# EAGLE design RFID_reva (EAGLE 7.2.0)

## Sheet 1 of 2
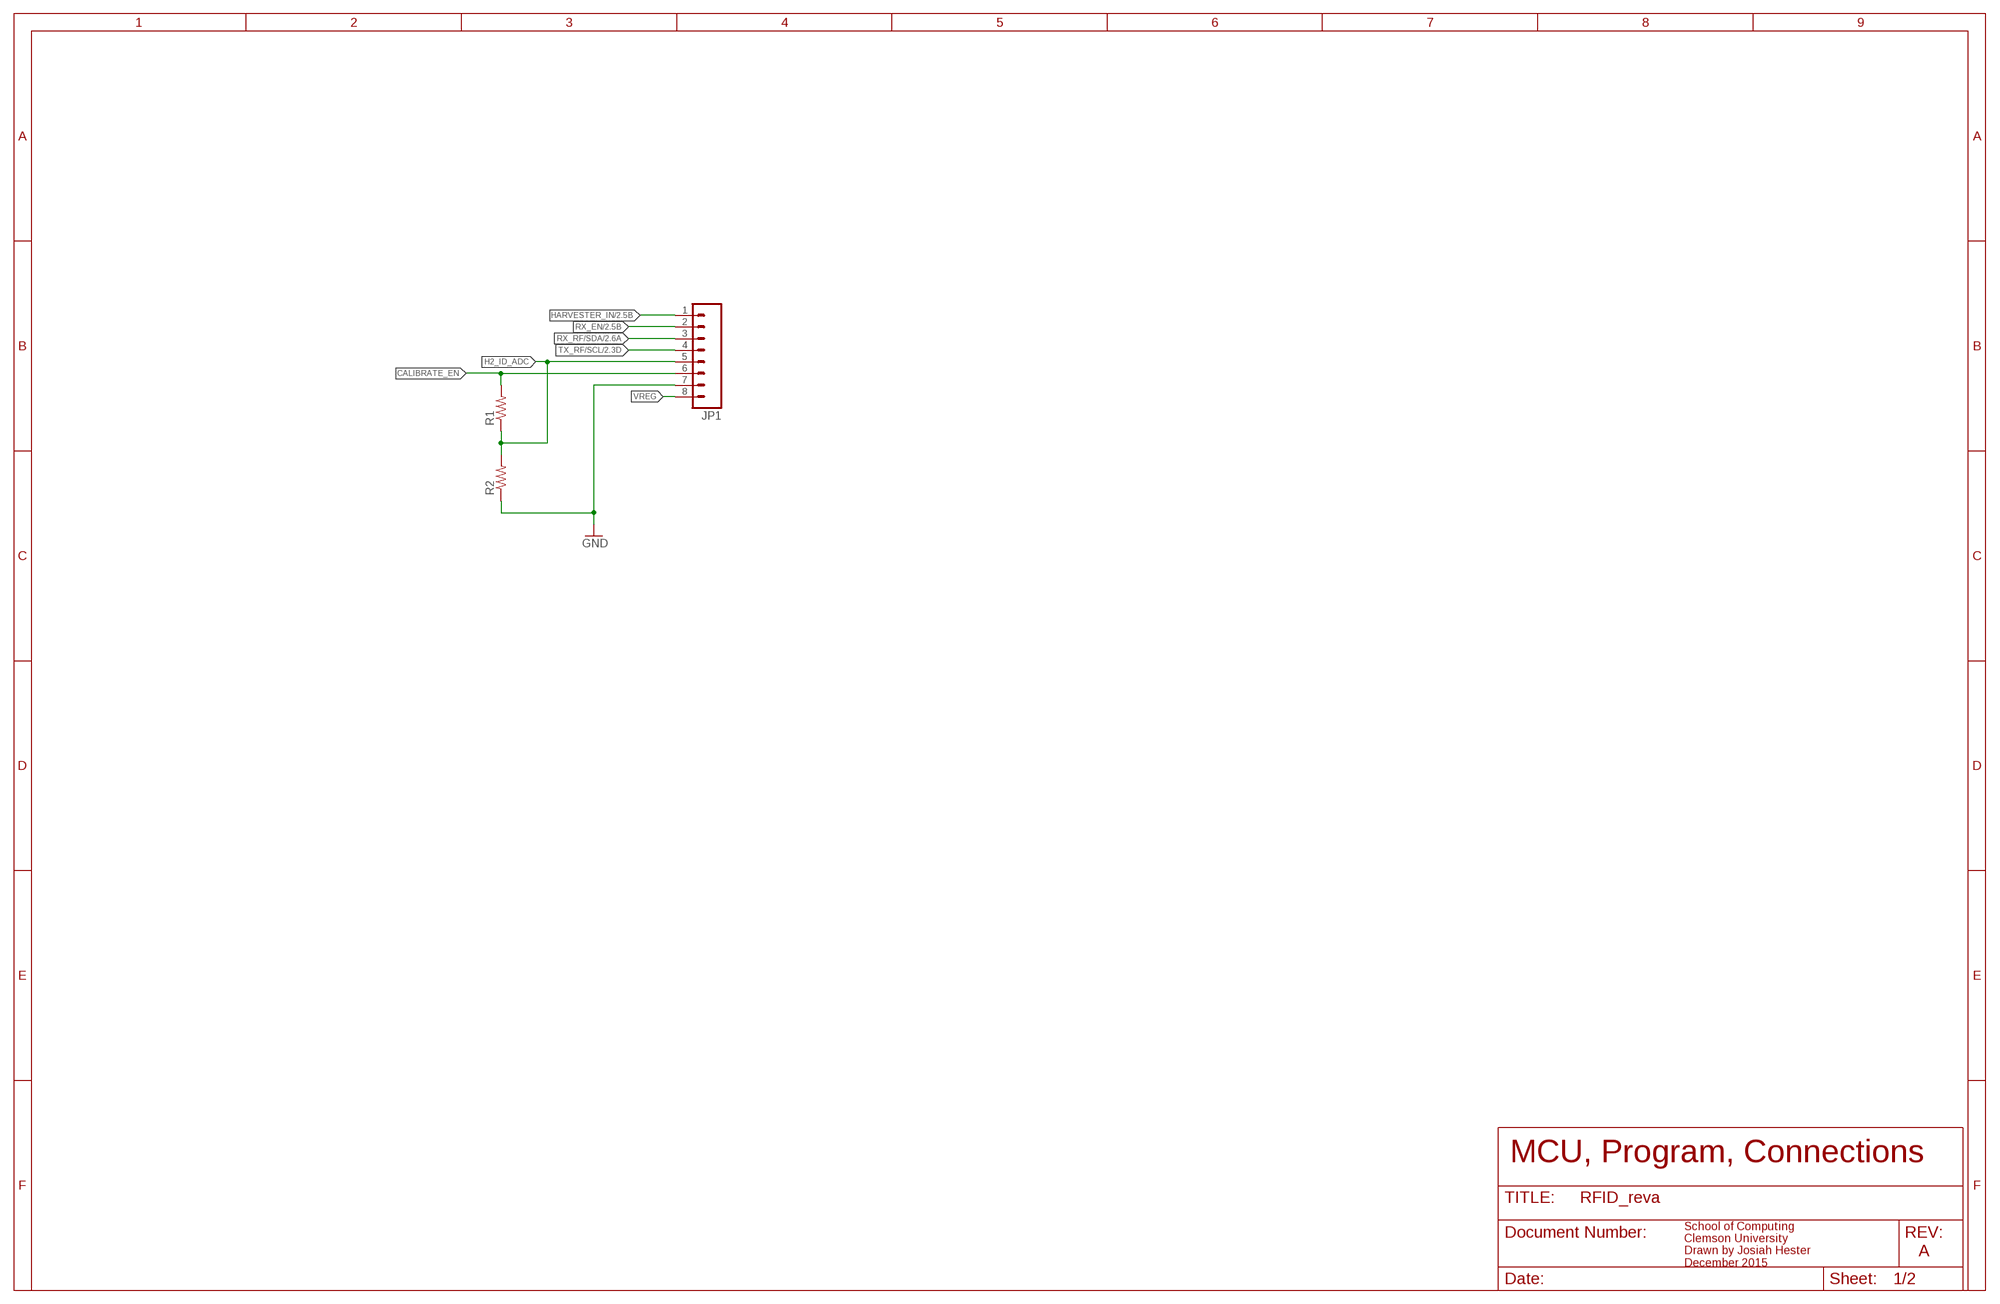
[diagram p0: schematic, sheet 1]

### Parts
JP1  M081.27MM  [1X08-1.27MM]
R1  R-EU0603  [0603]
R2  R-EU0603  [0603]

### Nets
CALIBRATE_EN: JP1.6 R1.2
GND: JP1.7 R2.1 ; also sheet 2
H2_ID_ADC: JP1.5 R1.1 R2.2
HARVESTER_IN: JP1.1 ; also sheet 2
RX_EN: JP1.2 ; also sheet 2
RX_RF/SDA: JP1.3 ; also sheet 2
TX_RF/SCL: JP1.4 ; also sheet 2
VREG: JP1.8 ; also sheet 2

### Notes on the sheet
- MCU, Program, Connections
- A
- School of Computing
  Clemson University
  Drawn by Josiah Hester
  December 2015

## Sheet 2 of 2
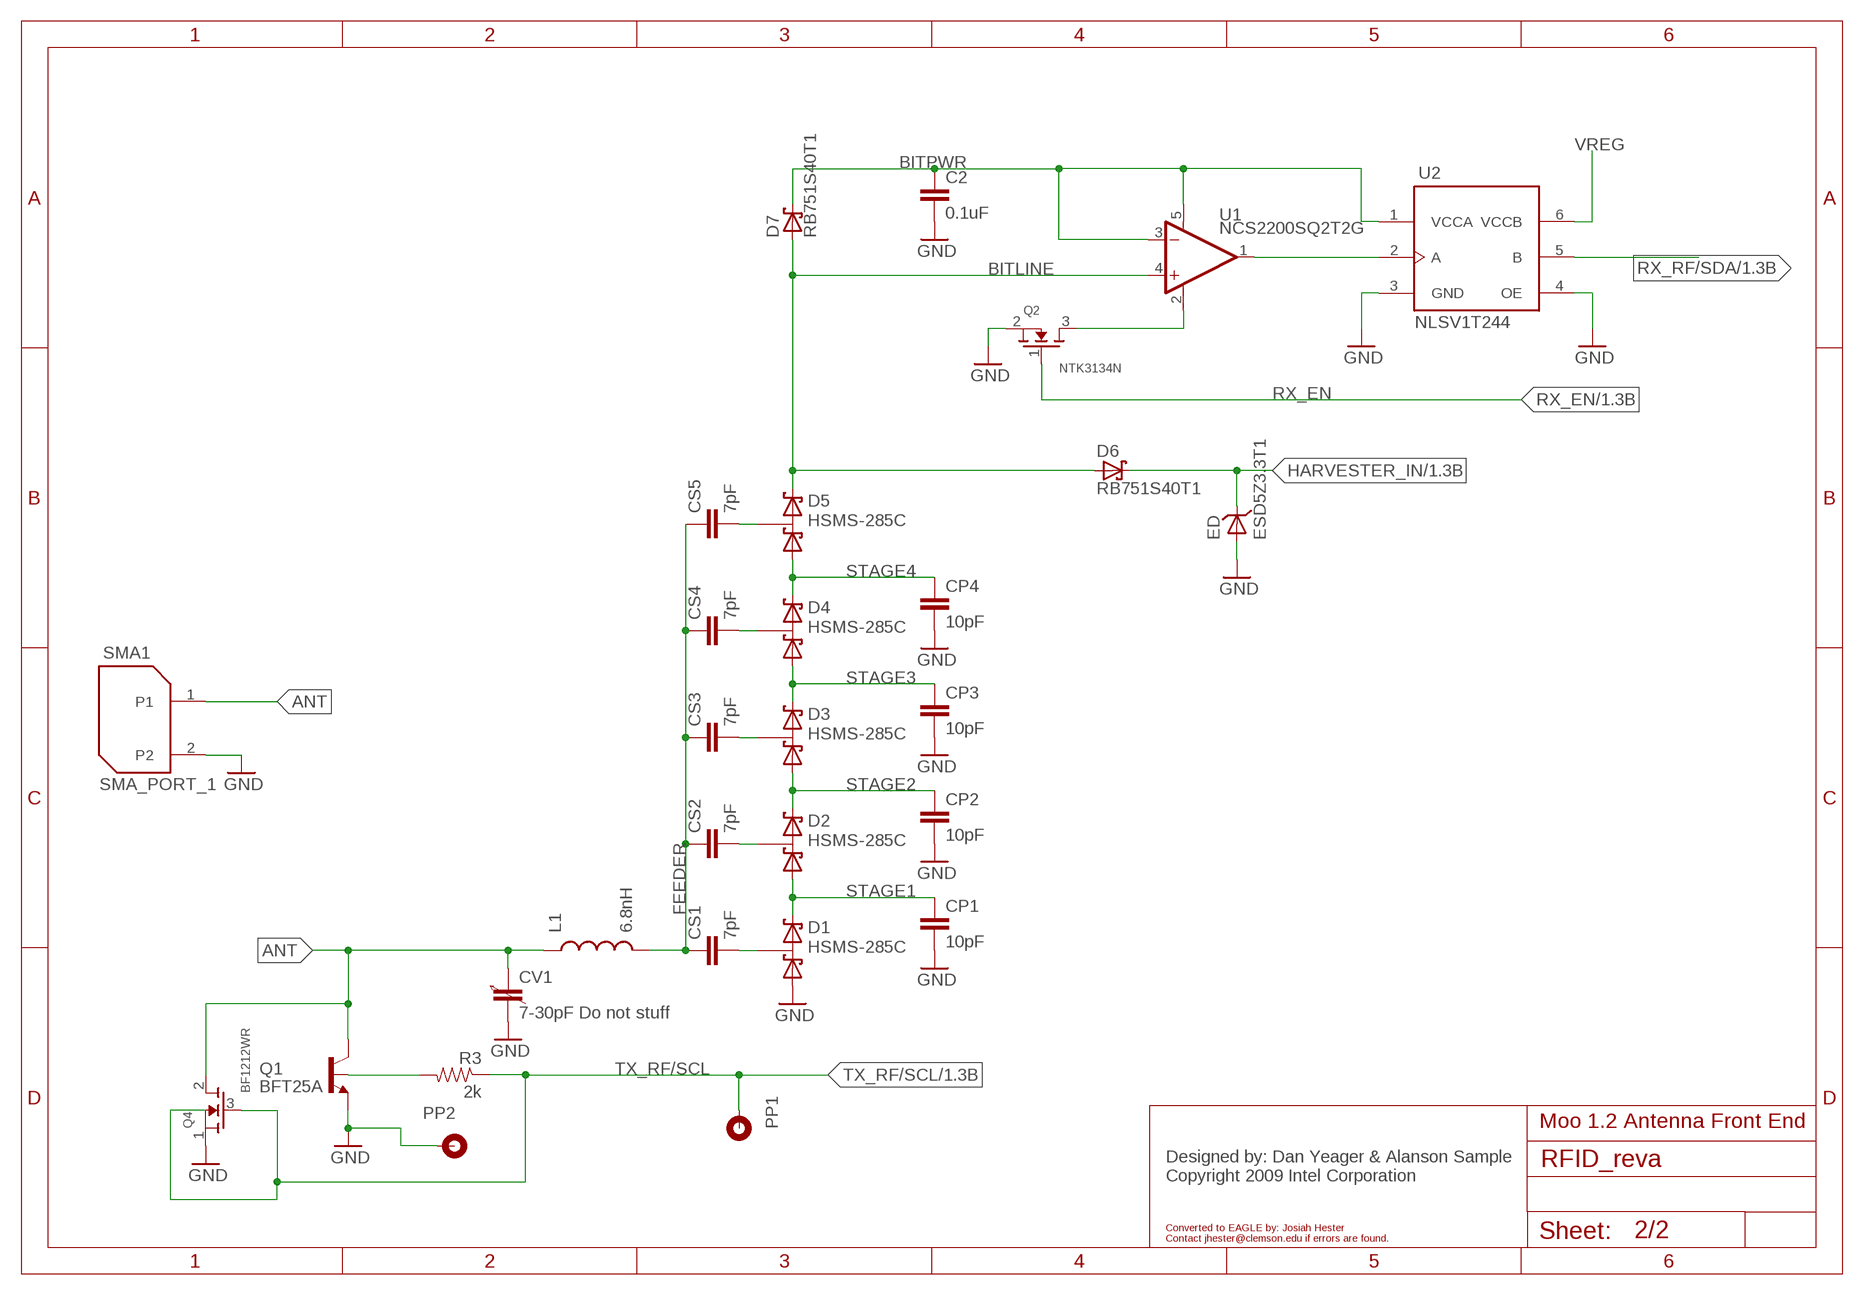
[diagram p1: schematic, sheet 2]

### Parts
C2  0.1uF  0402_1  [0402_1PRIMARY]
CP1  10pF  0402_1  [0402_1PRIMARY]
CP2  10pF  0402_1  [0402_1PRIMARY]
CP3  10pF  0402_1  [0402_1PRIMARY]
CP4  10pF  0402_1  [0402_1PRIMARY]
CS1  7pF  0402_1  [0402_1PRIMARY]
CS2  7pF  0402_1  [0402_1PRIMARY]
CS3  7pF  0402_1  [0402_1PRIMARY]
CS4  7pF  0402_1  [0402_1PRIMARY]
CS5  7pF  0402_1  [0402_1PRIMARY]
CV1  7-30pF Do not stuff  VAR-CAP_603_1  [VAR-CAP_603_1PRIMARY]
D1  HSMS-285C  [SOT-323,_HSMS-285C_1PRIMARY]
D2  HSMS-285C  [SOT-323,_HSMS-285C_1PRIMARY]
D3  HSMS-285C  [SOT-323,_HSMS-285C_1PRIMARY]
D4  HSMS-285C  [SOT-323,_HSMS-285C_1PRIMARY]
D5  HSMS-285C  [SOT-323,_HSMS-285C_1PRIMARY]
D6  RB751S40T1  [SOD-523_1PRIMARY]
D7  RB751S40T1  [SOD-523_1PRIMARY]
ED  ESD5Z3.3T1  [SOD-523_1PRIMARY]
L1  6.8nH  0603_1  [0603_1PRIMARY]
PP1  PROBE_POINT_2  [PROBE_POINT_2PRIMARY]
PP2  PROBE_POINT_1  [PROBE_POINT_2PRIMARY]
Q1  BFT25A  [SOT-23_1PRIMARY]
Q2  NTK3134N  [SOT723_1PRIMARY]
Q4  BF1212WR  [SOT343R_1PRIMARY]
R3  2k  0402RES  [0402_1PRIMARY]
SMA1  SMA_PORT_1  [SMA_PORT_1PRIMARY]
U1  NCS2200SQ2T2G  [SC70-5_1PRIMARY]
U2  NLSV1T244  [UDFN6_1PRIMARY]

### Nets
ANT: CV1.1 L1.1 Q1.3(C) Q4.2 SMA1.1
BITLINE: D5.2 D6.2(A) D7.2(A) U1.4
BITPWR: C2.1 D7.1(C) U1.3 U1.5 U2.1(VCCA)
CONTROL: Q1.1(B) R3.1
FEEDER: CS1.1 CS2.1 CS3.1 CS4.1 CS5.1 L1.2
GND: C2.2 CP1.2 CP2.2 CP3.2 CP4.2 CV1.2 D1.1 ED.2 PP2.1 Q1.2(E) Q2.2 Q4.1 SMA1.2 U2.3(GND) U2.4(OE) ; also sheet 1
HARVESTER_IN: D6.1(C) ED.1 ; also sheet 1
N$1: U1.1 U2.2(A)
N$2: Q2.3 U1.2
NETCS1_2: CS1.2 D1.3
NETCS2_2: CS2.2 D2.3
NETCS3_2: CS3.2 D3.3
NETCS4_2: CS4.2 D4.3
NETCS5_2: CS5.2 D5.3
RX_EN: Q2.1 ; also sheet 1
RX_RF/SDA: U2.5(B) ; also sheet 1
STAGE1: CP1.1 D1.2 D2.1
STAGE2: CP2.1 D2.2 D3.1
STAGE3: CP3.1 D3.2 D4.1
STAGE4: CP4.1 D4.2 D5.1
TX_RF/SCL: PP1.1 Q4.3 Q4.4 R3.2 ; also sheet 1
VREG: U2.6(VCCB) ; also sheet 1

### Notes on the sheet
- Moo 1.2 Antenna Front End
- Designed by: Dan Yeager & Alanson Sample
  Copyright 2009 Intel Corporation
- Converted to EAGLE by: Josiah Hester
  Contact jhester@clemson.edu if errors are found.

## Library data of the parts
C2 CP1-CP4 CS4 CS5 = Moo1.2:0402_1
CS1-CS3 = Moo1.2:0402_1; DIGIKEY: 490-5878-1-ND
CV1 = Moo1.2:VAR-CAP_603_1
D1-D5 = Moo1.2:HSMS-285C
D6 D7 = Moo1.2:RB751S40T1
ED = Moo1.2:ESD5Z3.3T1
JP1 = SparkFun-Connectors:M08: Header 8 Standard 8-pin 0.1" header. Use with straight break away headers (SKU : PRT-00116), right angle break away headers (PRT-00553), swiss pins (PRT-00743), machine pins (PRT-00117), and female headers (PRT-00115).; DIGIKEY: 1212-1352-ND
L1 = Moo1.2:0603_1
PP1 = Moo1.2:PROBE_POINT_2
PP2 = Moo1.2:PROBE_POINT_1
Q1 = Moo1.2:BFT25A; DIGIKEY: 568-1992-1-ND
Q2 = Moo1.2:NTK3134N
Q4 = Moo1.2:BF1212WR
R1 R2 = tiny_passives:R-EU
R3 = Moo1.2:0402RES
SMA1 = Moo1.2:SMA_PORT_1
U1 = Moo1.2:NCS2200SQ2T2G
U2 = Moo1.2:NLSV1T244

## Board
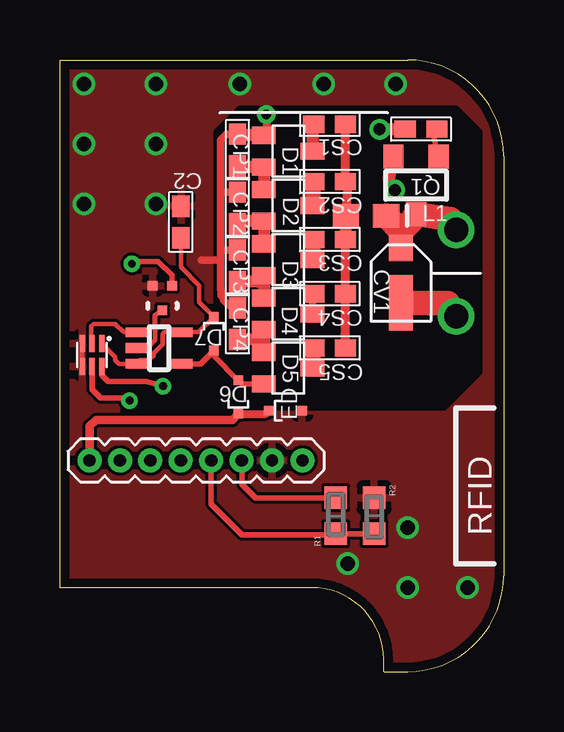
[diagram p2: board, top side]
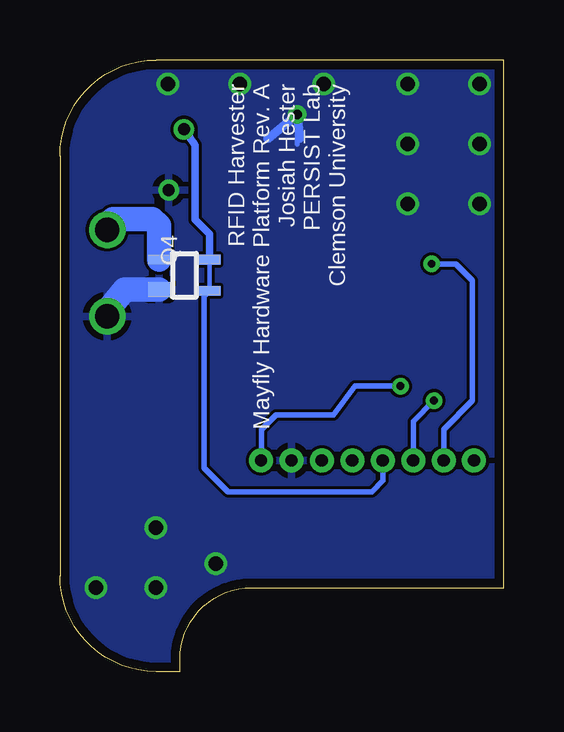
[diagram p3: board, bottom side, seen from below]

Size 18.5 x 25.5 mm. Coordinates in mm from the lower left corner, seen from the top.
Outline: 10.5,3.5 0,3.5 0,25.5 14.5,25.5 arc-90 18.5,21.5 18.5,4 arc-90 14.5,0 13.5,0 13.5,0.5 arc90 10.5,3.5
Copper layers (1*16): Top 0.0356mm / dielectric 1.5011mm / Bottom 0.0356mm
Design rules "PCBUnlimited": minimum track width 5mil, minimum drill 8mil, track to track 5mil, track to pad 5mil, pad to pad 5mil, via to via 5mil, smd to smd 5mil, copper to edge 15mil, drill to drill 5mil, minimum pad ring 7mil, minimum via ring 7mil, stop-mask expansion 3mil, vias tented up to drill 0mil, thermal gap 10mil

### Footprints (pad centres in the part's own frame; a part is rotated, then mirrored left to right if it is on the bottom)
0402_1PRIMARY = smd 0.889 x 0.711: 1 -0.66,0; 2 0.66,0
VAR-CAP_603_1PRIMARY = smd 1.092 x 0.991: 1 -1.448,0 | smd 2.311 x 0.991: 2 0.838,0
SOT-323,_HSMS-285C_1PRIMARY = smd 0.711 x 0.991: 1 -0.66,-1.016; 2 0.66,-1.016; 3 0,1.016
SOD-523_1PRIMARY = smd 0.406 x 0.406: 1 0,0; 2 0,-1.397
1X08-1.27MM = drill 0.508 pad 1: 1 0,0; 2 1.27,0; 3 2.54,0; 4 3.81,0; 5 5.08,0; 6 6.35,0; 7 7.62,0; 8 8.89,0
0603_1PRIMARY = smd 1.092 x 0.991: 1 -0.838,0; 2 0.838,0
PROBE_POINT_2PRIMARY = drill 0.508 pad 0.762: 1 0,0
SOT-23_1PRIMARY = smd 0.838 x 0.991: 1 -0.94,-1.194; 2 0.94,-1.194; 3 0,1.194
SOT723_1PRIMARY = smd 0.406 x 0.406: 1 -0.508,0.406; 2 -0.508,-0.406; 3 0.508,0
SOT343R_1PRIMARY = smd 0.61 x 0.914: 1 0.584,-1.016 | smd 0.406 x 0.914: 2 -0.66,-1.016; 3 -0.66,1.092; 4 0.635,1.092
0603 = smd 0.95 x 0.95: 1 -0.75,0; 2 0.75,0
SMA_PORT_1PRIMARY = drill 1.016 pad 1.397: 1 0,1.803; 2 0,-1.803
SC70-5_1PRIMARY = smd 0.406 x 0.914: 1 -0.66,-0.94; 2 0,-0.94; 3 0.66,-0.94; 4 0.66,0.94; 5 -0.66,0.94
UDFN6_1PRIMARY = smd 0.229 x 0.711: 1 -0.406,-0.483; 2 0,-0.483; 3 0.406,-0.483; 4 0.406,0.483; 5 0,0.483; 6 -0.406,0.483

### Placement (x,y rotation side)
C2  5.04,18.74 90 top
CP1  7.41,21.75 90 top
CP2  7.41,19.33 90 top
CP3  7.41,16.92 90 top
CP4  7.41,14.51 90 top
CS1  11.25,22.81 180 top
CS2  11.25,20.42 180 top
CS3  11.25,18.01 180 top
CS4  11.25,15.75 180 top
CS5  11.25,13.49 180 top
CV1  14.22,16.21 270 top
D1  9.52,21.69 270 top
D2  9.52,19.43 270 top
D3  9.52,17.17 270 top
D4  9.52,14.91 270 top
D5  9.52,12.65 270 top
D6  7.44,10.75 180 top
D7  6.42,14.79 0 top
ED  8.71,10.87 90 top
JP1  1.23,8.8 0 top
L1  12.77,19 180 top
PP1  13.33,22.61 270 top
PP2  13.96,20.07 180 top
Q1  14.85,20.27 180 top
Q2  4.27,15.57 270 top
Q4  13.35,16.51 270 bottom
R1  11.5,6.5 90 top
R2  13.1,6.5 270 top
R3  15.06,22.61 180 top
SMA1  16.53,16.61 0 top
U1  4.13,13.49 270 top
U2  1.33,13.2 180 top

### Tracks (layer width: path | path; a pad name or v marks a point on that pad's centre or on a via)
ANT
  Top 1.016: SMA1.1 16.27,18.88 Q1.3 14.65,18.77 14.22,18.34 | CV1.1 14.22,18.34 | 14.22,18.34 L1.1
  Bottom 1.016: Q4.2 14.37,18.6 14.65,18.88 16.27,18.88 SMA1.1
BITLINE
  Top 0.152: 8.45,11.97 8.48,11.94
  Top 0.222: U1.4 5.86,12.83 D7.2 6.42,13.16 D6.2 7.59,11.99 8.3,11.99
  Top 0.254: 8.45,11.99 8.3,11.99
  Top 0.305: D5.2 8.45,11.97 | 8.48,11.94 8.35,11.81 | 8.63,11.99 D5.2 | D5.2 8.45,11.99
BITPWR
  Top 0.178: U1.3 3.34,12.98 3.7,12.98 3.88,13.16 3.9,13.16 3.9,13.26 4.28,13.64 4.28,14.07 4.36,14.15 U1.5 5.78,14.15 D7.1 5.8,15.41 5.8,16.1 5.04,16.86 C2.1
  Top 0.18: U1.3 2.47,12.83 2.3,13 2.3,13.12 U2.1
  Top 0.203: D7.1 6.42,14.63
CALIBRATE_EN
  Top 0.222: R1.2 8.15,7.25 7.6,7.8 7.6,8.78 JP1.6
CONTROL
  Top 0.203: Q1.1 15.59,22.28 R3.1
FEEDER
  Top 0.152: 12.01,18.06 CS3.1
  Top 0.381: CS5.1 CS4.1 CS3.1 | L1.2 12.01,20.12 CS2.1 CS1.1
  Top 0.508: 12.01,18.06 11.93,18.06 L1.2
GND  (via drill 0.41 pad 0.61, 0.6)
  Top 0.152: 7.49,22.66 7.49,22.56 7.64,22.41 | D1.1 8.5,22.33 | CP1.2 7.64,22.41 | 7.64,22.41 7.69,22.36 | 6.62,17.15 6.62,17.05 6.7,16.97
  Top 0.178: 5.91,17.15 5.91,17.17
  Top 0.203: U2.4 U2.3
  Top 0.305: 6.7,19.99 6.7,22.15 6.95,22.41 CP1.2 | 6.7,19.99 6.7,17.58 | 6.7,17.58 6.7,16.97 6.7,15.93 6.72,15.88 6.72,15.68 6.83,15.57 6.83,15.5 7.18,15.17 CP4.2 | 6.62,17.15 5.91,17.15 | CP2.2 6.7,19.99 | CP3.2 6.7,17.58
  Top 0.33: v8.6,23.23 8.6,22.6 8.5,22.5
  Top 0.508: 8.55,22.36 D1.1 7.69,22.36 7.51,22.36 | Q1.2 13.71,20.59 arc45 13.9,20.14 PP2.1
  Top 1.016: CV1.2 16.17,15.37 SMA1.2
  Bottom 0.203: SMA1.2 arc-45 16.73,14.81 16.63,14.91 | v8.6,23.23 8.6,21.97
  Bottom 0.381: 9.82,22.23 v8.6,23.23 8.5,22.23
  Bottom 1.016: Q4.1 15.79,15.93 16.63,14.91 16.73,14.79
  other vias: 4,19.5 1,19.5 1,22 1,24.5 4,24.5 4,22 14.5,6 17,3.5 12,4.5 14.5,3.5 14,24.5 11,24.5 7.5,24.5
  pour Top: -0.5,-0.5 18,-0.5 18,25.5 0,25.5
  pour Bottom: -0.5,-0.5 18,-0.5 18,25.5 -0.5,25.5
H2_ID_ADC
  Top 0.222: JP1.5 6.31,6.99 7.6,5.7 11.45,5.7 R1.1 R2.2
HARVESTER_IN
  Top 0.33: D6.1 8.58,10.75 ED.1
  Top 0.35: JP1.1 1.23,10.23 1.5,10.5 7.19,10.5 D6.1
N$1
  Top 0.18: U1.1 2.65,14.15 2.3,14.5 1.4,14.5 1.3,14.4 1.3,13.72 U2.2
N$2
  Top 0.178: 3.65,13.49 3.98,13.82 3.98,14.22
  Top 0.203: U1.2 3.65,13.49 | 3.98,14.22 3.96,14.71 3.96,14.86 Q2.3
N$4
  cutout Top: 6.5,12.5 8,11 16,11 17.5,12.5 17.5,22.5 16.5,23.5 7.5,23.5 6.5,22.5
NETCS1_2
  Top 0.152: 10.61,21.77 D1.3
  Top 0.508: CS1.2 10.54,22.81 D1.3
NETCS2_2
  Top 0.152: 10.56,20.25 CS2.2 | 10.59,19.51 10.59,19.48 D2.3
  Top 0.635: 10.56,20.25 10.56,19.54 10.59,19.51
NETCS3_2
  Top 0.152: 10.61,17.25 D3.3 | 10.56,17.93 CS3.2
  Top 0.635: 10.61,17.25 10.56,17.3 10.56,17.93
NETCS4_2
  Top 0.305: D4.3 10.54,15.7 CS4.2
NETCS5_2
  Top 0.152: 10.59,13.39 CS5.2 | 10.56,12.68 D5.3
  Top 0.635: 10.59,13.39 10.56,13.36 10.56,12.68
RX_EN  (via drill 0.33)
  Top 0.222: Q2.1 4.67,16.53 4.1,17.1 3.1,17.1 v3,17
  Bottom 0.222: JP1.2 2.5,10.1 1.3,11.3 1.3,16.3 2,17 v3,17
RX_RF/SDA  (via drill 0.33)
  Top 0.222: U2.5 1.33,11.77 1.7,11.4 2.8,11.4 v2.9,11.3
  Bottom 0.222: v2.9,11.3 3.77,10.43 JP1.3
STAGE1
  Top 0.508: CP1.1 7.46,21.03 D1.2 D2.1
STAGE2
  Top 0.508: CP2.1 7.51,18.77 D2.2 D3.1
STAGE3
  Top 0.508: CP3.1 8.25,16.26 D3.2 D4.1
STAGE4
  Top 0.508: CP4.1 8.1,13.85 D4.2 D5.1
TX_RF/SCL
  Top 0.508: PP1.1 R3.2
  Bottom 0.178: Q4.3 Q4.4
  Bottom 0.222: JP1.4 5.04,7.96 5.5,7.5 11.5,7.5 12.5,8.5 12.5,15.64 Q4.4
  Bottom 0.305: Q4.3 12.26,18.24 12.87,18.85 12.87,21.95 PP1.1
VREG  (via drill 0.33)
  Top 0.222: U2.6 1.74,12.36 2,12.1 3.6,12.1 v4.3,11.9
  Bottom 0.222: v4.3,11.9 6.2,11.9 7.1,10.7 9.5,10.7 10.1,10.1 10.1,8.82 JP1.8

### Text on the board
tPlace: RFID
bPlace: RFID Harvester / Mayfly Hardware Platform Rev. A / Josiah Hester / PERSIST Lab / Clemson University